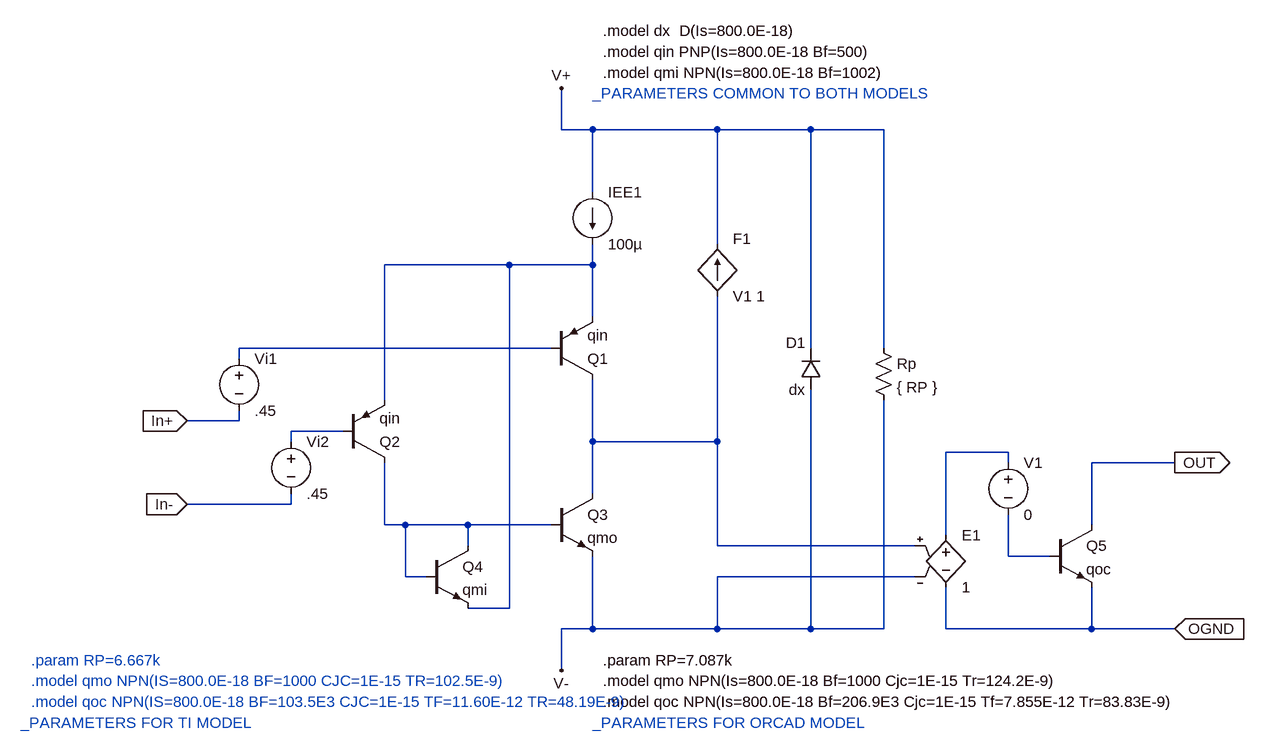
[diagram p0: schematic Lm311x.asc]
Lm311x.asc, the LTspice schematic file:
Version 4
SHEET 1 1984 1000
WIRE 320 -160 320 -96
WIRE 320 -96 368 -96
WIRE 320 736 320 672
WIRE 320 672 368 672
WIRE 864 592 560 592
WIRE 560 592 560 672
WIRE 560 160 560 384
WIRE 560 544 864 544
WIRE 560 80 560 -96
WIRE 912 528 912 400
WIRE 912 400 1008 400
WIRE 1008 400 1008 416
WIRE 1008 496 1008 560
WIRE 1008 560 1072 560
WIRE 912 608 912 672
WIRE 912 672 1136 672
WIRE 1136 608 1136 672
WIRE 1136 672 1264 672
WIRE 1136 512 1136 416
WIRE 1136 416 1264 416
WIRE 560 -96 704 -96
WIRE 816 -96 816 240
WIRE 816 320 816 672
WIRE 816 672 704 672
WIRE 704 304 704 672
WIRE 704 672 560 672
WIRE 704 240 704 -96
WIRE 704 -96 816 -96
WIRE 368 560 368 672
WIRE 368 672 560 672
WIRE 368 464 368 384
WIRE 368 384 560 384
WIRE 560 384 560 544
WIRE 368 -96 368 0
WIRE 368 -96 560 -96
WIRE 368 80 368 112
WIRE 368 288 368 384
WIRE -176 352 -176 336
WIRE -176 256 -176 240
WIRE -176 240 304 240
WIRE -176 352 -256 352
WIRE 368 112 240 112
WIRE 368 112 368 192
WIRE 48 112 48 320
WIRE 48 416 48 512
WIRE 48 512 80 512
WIRE -96 480 -96 464
WIRE -96 384 -96 368
WIRE -96 368 -16 368
WIRE -96 480 -256 480
WIRE 176 512 304 512
WIRE 240 640 240 112
WIRE 240 112 48 112
WIRE 176 544 176 512
WIRE 176 640 240 640
WIRE 112 592 80 592
WIRE 80 592 80 512
WIRE 80 512 176 512
FLAG 320 -160 V+
FLAG 320 736 V-
FLAG 1264 416 OUT
IOPIN 1264 416 Out
FLAG 1264 672 OGND
IOPIN 1264 672 In
FLAG -256 352 In+
IOPIN -256 352 In
FLAG -256 480 In-
IOPIN -256 480 In
SYMBOL res 800 224 R0
SYMATTR InstName Rp
SYMATTR Value { RP }
SYMBOL diode 720 304 R180
WINDOW 0 24 72 Left 0
WINDOW 3 24 0 Left 0
SYMATTR InstName D1
SYMATTR Value dx
SYMBOL e 912 512 R0
SYMATTR InstName E1
SYMATTR Value 1
SYMBOL f 560 160 M180
WINDOW 0 24 88 Left 0
WINDOW 3 24 0 Left 0
SYMATTR InstName F1
SYMATTR Value V1 1
SYMBOL npn2 1072 512 R0
SYMATTR InstName Q5
SYMATTR Value qoc
SYMBOL voltage 1008 400 R0
SYMATTR InstName V1
SYMATTR Value 0
SYMBOL npn2 304 464 R0
SYMATTR InstName Q3
SYMATTR Value qmo
SYMBOL current 368 0 R0
WINDOW 123 0 0 Left 0
WINDOW 39 0 0 Left 0
SYMATTR InstName IEE1
SYMATTR Value 100µ
SYMBOL pnp2 304 288 M180
SYMATTR InstName Q1
SYMATTR Value qin
SYMBOL voltage -176 240 R0
WINDOW 123 0 0 Left 0
WINDOW 39 0 0 Left 0
SYMATTR InstName Vi1
SYMATTR Value .45
SYMBOL pnp2 -16 416 M180
SYMATTR InstName Q2
SYMATTR Value qin
SYMBOL voltage -96 368 R0
WINDOW 123 0 0 Left 0
WINDOW 39 0 0 Left 0
SYMATTR InstName Vi2
SYMATTR Value .45
SYMBOL npn2 112 544 R0
SYMATTR InstName Q4
SYMATTR Value qmi
TEXT 384 -216 Left 0 !.model qin PNP(Is=800.0E-18 Bf=500)
TEXT 384 -184 Left 0 !.model qmi NPN(Is=800.0E-18 Bf=1002)
TEXT 384 752 Left 0 !.model qmo NPN(Is=800.0E-18 Bf=1000 Cjc=1E-15 Tr=124.2E-9)
TEXT 384 784 Left 0 !.model qoc NPN(Is=800.0E-18 Bf=206.9E3 Cjc=1E-15 Tf=7.855E-12 Tr=83.83E-9)
TEXT 384 -248 Left 0 !.model dx  D(Is=800.0E-18)
TEXT -496 752 Left 0 ;.model qmo NPN(IS=800.0E-18 BF=1000 CJC=1E-15 TR=102.5E-9)
TEXT 384 720 Left 0 !.param RP=7.087k
TEXT -496 720 Left 0 ;.param RP=6.667k
TEXT -496 784 Left 0 ;.model qoc NPN(IS=800.0E-18 BF=103.5E3 CJC=1E-15 TF=11.60E-12 TR=48.19E-9)
TEXT 368 -152 Left 0 ;_PARAMETERS COMMON TO BOTH MODELS
TEXT 368 816 Left 0 ;_PARAMETERS FOR ORCAD MODEL
TEXT -512 816 Left 0 ;_PARAMETERS FOR TI MODEL

The netlist it stands for:
* Lm311x.asc
Rp V+ V- { RP }
D1 V- V+ dx
E1 N002 OGND N001 V- 1
F1 N001 V+ V1 1
Q5 OUT N003 OGND 0 qoc
V1 N002 N003 0
Q3 N001 N006 V- 0 qmo
IEE1 V+ N004 100µ
Q1 N001 N005 N004 0 qin
Vi1 N005 In+ .45
Q2 N006 N007 N004 0 qin
Vi2 N007 In- .45
Q4 N006 N006 N004 0 qmi
.model D D
.lib standard.dio
.model NPN NPN
.model PNP PNP
.lib standard.bjt
.model qin PNP(Is=800.0E-18 Bf=500)
.model qmi NPN(Is=800.0E-18 Bf=1002)
.model qmo NPN(Is=800.0E-18 Bf=1000 Cjc=1E-15 Tr=124.2E-9)
.model qoc NPN(Is=800.0E-18 Bf=206.9E3 Cjc=1E-15 Tf=7.855E-12 Tr=83.83E-9)
.model dx  D(Is=800.0E-18)
* .model qmo NPN(IS=800.0E-18 BF=1000 CJC=1E-15 TR=102.5E-9)
.param RP=7.087k
* .param RP=6.667k
* .model qoc NPN(IS=800.0E-18 BF=103.5E3 CJC=1E-15 TF=11.60E-12 TR=48.19E-9)
* _PARAMETERS COMMON TO BOTH MODELS
* _PARAMETERS FOR ORCAD MODEL
* _PARAMETERS FOR TI MODEL
.backanno
.end